# EasyEDA schematic SCH_Bitcoin-Tracker_2024-07-20.json
TITLE: Sheet_1; REV: 1.0; Date: 2023-04-04; Sheet: 1/1; Drawn By: AMAN; Company: BITCOIN TRACKER
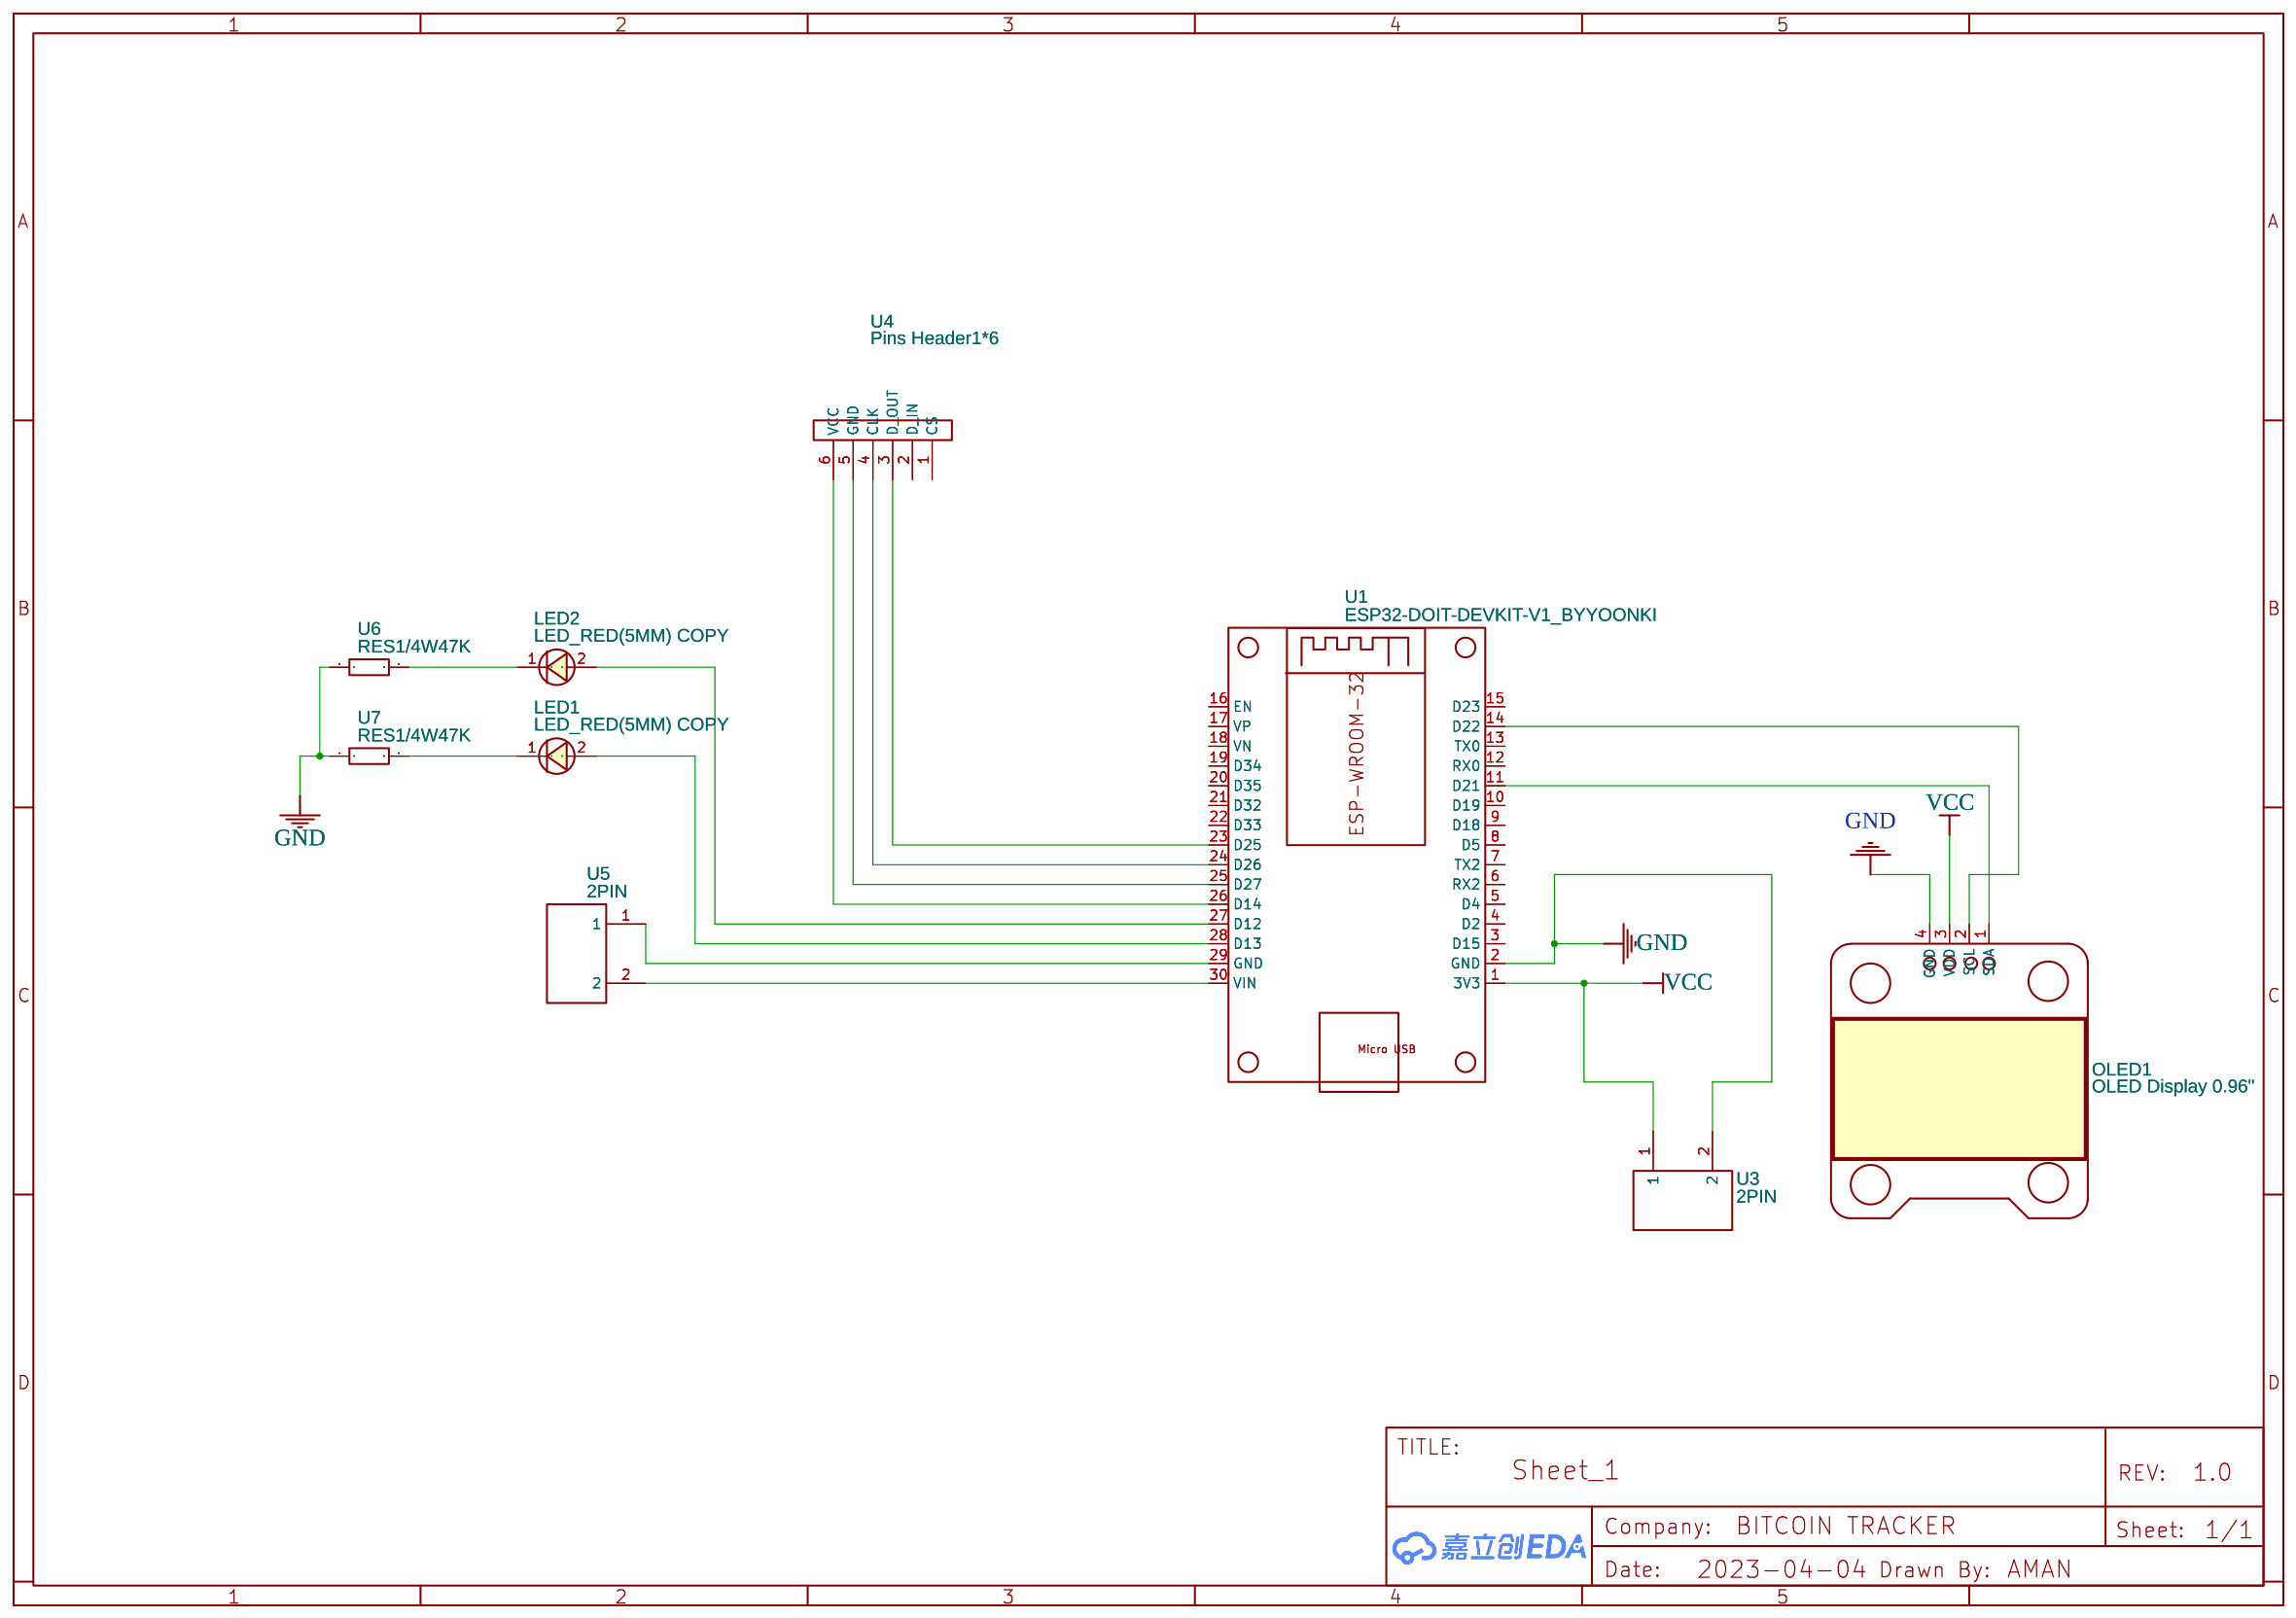
[diagram p0: schematic sheet]

## Parts
LED1  LED_RED(5MM) COPY  [LED 5MM_M COPY]
LED2  LED_RED(5MM) COPY  [LED 5MM_M COPY]
OLED1  OLED Display 0.96"  [OLED DISPLAY 0.96"]
U1  ESP32-DOIT-DEVKIT-V1_BYYOONKI  [ESP32-DOIT-DEVKIT-V1_BYYOONKI]
U3  2PIN  [2PIN]
U4  Pins Header1*6  [PINS-HEADER1*6]
U5  2PIN  [2PIN]
U6  RES1/4W47K  [RES-TH_BD2.3-L6.5-P10.50-D0.5]
U7  RES1/4W47K  [RES-TH_BD2.3-L6.5-P10.50-D0.5]

## Library data of the parts
LED1 LED2 = LED_RED(5MM) COPY: Manufacturer Part: LED 5MM; Contributor: michaelmchen
OLED1 = OLED Display 0.96": Contributor: mousercircuits
U1 = ESP32-DOIT-DEVKIT-V1_BYYOONKI: Manufacturer Part: ESP32_DOIT_DEVKIT_30_PIN; Contributor: Miketam99
U3 U5 = 2PIN: Contributor: juk25760
U4 = Pins Header1*6: Contributor: Nattanan
U6 U7 = RES1/4W47K: Supplier: LCSC; Supplier Part: C9900002914; Manufacturer: null; JLCPCB Part Class: Extended Part; Contributor: LCSC

## Nets
GND: OLED1.4(GND) U1.2(GND) U3.2 U6.1 U7.1
VCC: OLED1.3(VDD) U1.1(3V3) U3.1
Net-(LED1-1): LED1.1(K) U7.2
Net-(LED1-2): LED1.2(A) U1.28(D13)
Net-(LED2-1): LED2.1(K) U6.2
Net-(LED2-2): LED2.2(A) U1.27(D12)
Net-(OLED1-1): OLED1.1(SDA) U1.11(D21)
Net-(OLED1-2): OLED1.2(SCL) U1.14(D22)
Net-(U1-23): U1.23(D25) U4.3(D_OUT)
Net-(U1-24): U1.24(D26) U4.4(CLK)
Net-(U1-25): U1.25(D27) U4.5(GND)
Net-(U1-26): U1.26(D14) U4.6(VCC)
Net-(U1-29): U1.29(GND) U5.1
Net-(U1-30): U1.30(VIN) U5.2

Not connected (* = marked no-connect by the designer): U1 3(D15) 4(D2) 5(D4) 6(RX2) 7(TX2) 8(D5) 9(D18) 10(D19) 12(RX0) 13(TX0) 15(D23) 16(EN) 17(VP) 18(VN) 19(D34) 20(D35) 21(D32) 22(D33); U4 1(CS) 2(D_IN)
